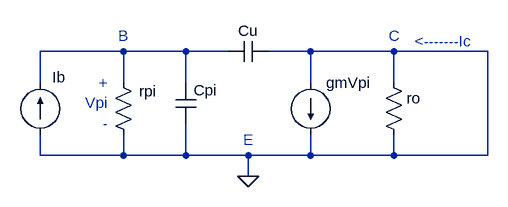
[diagram p0: schematic BJT_CE_hybrid-pi-simplified.asc]
BJT_CE_hybrid-pi-simplified.asc, the LTspice schematic file:
Version 4
SHEET 1 880 680
WIRE 256 80 128 80
WIRE 352 80 256 80
WIRE 416 80 352 80
WIRE 544 80 480 80
WIRE 672 80 544 80
WIRE 816 80 672 80
WIRE 128 128 128 80
WIRE 256 128 256 80
WIRE 352 128 352 80
WIRE 544 128 544 80
WIRE 672 128 672 80
WIRE 128 240 128 208
WIRE 256 240 256 208
WIRE 256 240 128 240
WIRE 352 240 352 192
WIRE 352 240 256 240
WIRE 448 240 352 240
WIRE 544 240 544 208
WIRE 544 240 448 240
WIRE 672 240 672 208
WIRE 672 240 544 240
WIRE 816 240 816 80
WIRE 816 240 672 240
WIRE 448 272 448 240
FLAG 448 272 0
SYMBOL current 128 208 R180
WINDOW 0 -39 88 Left 2
WINDOW 3 24 0 Left 2
SYMATTR InstName Ib
SYMATTR Value ""
SYMBOL res 240 112 R0
WINDOW 0 40 29 Left 2
SYMATTR InstName rpi
SYMATTR Value ""
SYMBOL res 656 112 R0
SYMATTR InstName ro
SYMATTR Value ""
SYMBOL cap 336 128 R0
WINDOW 0 28 12 Left 2
SYMATTR InstName Cpi
SYMATTR Value ""
SYMBOL cap 480 64 R90
WINDOW 0 0 32 VBottom 2
WINDOW 3 32 32 VTop 2
SYMATTR InstName Cu
SYMATTR Value ""
SYMBOL current 544 128 R0
SYMATTR InstName gmVpi
SYMATTR Value ""
TEXT 232 128 Right 2 ;+\nVpi\n-
TEXT 248 56 Left 2 ;B
TEXT 664 56 Left 2 ;C
TEXT 440 216 Left 2 ;E
TEXT 704 64 Left 2 ;<-------Ic

The netlist it stands for:
* BJT_CE_hybrid-pi-simplified.asc
Ib 0 N001
rpi N001 0
ro 0 0
Cpi N001 0
Cu 0 N001
I§gmVpi 0 0
* +
* Vpi
* -
* B
* C
* E
* <-------Ic
.backanno
.end